# Altium schematic sheet jtag.SchDoc
size A
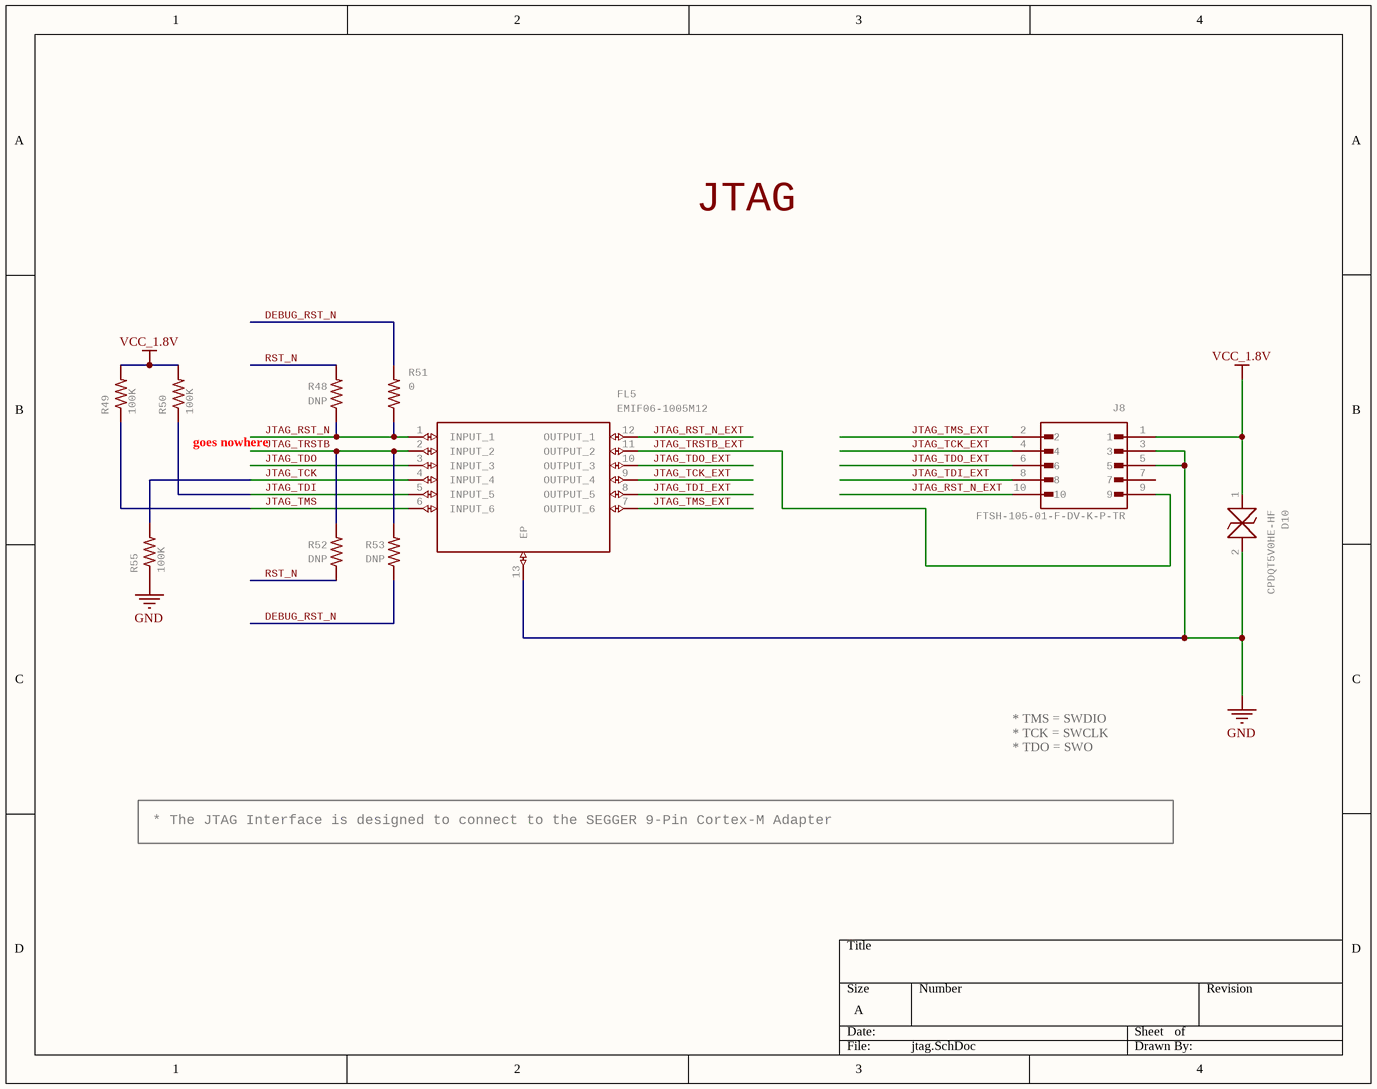
[diagram p0: jtag.SchDoc]

## Parts
D10  CPDQT5V0HE-HF  [CPDQT5V0HEHF]
FL5  EMIF06-1005M12  [SON40P150X250X65-13N]
J8  FTSH-105-01-F-DV-K-P-TR  [CNC_3221-10-0300-00]
R48  DNP  [0402-RES]
R49  100K  [R0201]
R50  100K  [R0201]
R51  0  [0402-RES]
R52  DNP  [0402-RES]
R53  DNP  [0402-RES]
R55  100K  [R0201]

## Nets
GND: D10.2 FL5.13(EP) J8.3 J8.5 R55.1
VCC_1.8V: D10.1 J8.1 R49.2 R50.2
DEBUG_RST_N: R51.2 R53.1
JTAG_RST_N: FL5.1(INPUT_1) R48.1 R51.1
JTAG_RST_N_EXT: FL5.12(OUTPUT_1) J8.10
JTAG_TCK: FL5.4(INPUT_4) R55.2
JTAG_TCK_EXT: FL5.9(OUTPUT_4) J8.4
JTAG_TDI: FL5.5(INPUT_5) R50.1
JTAG_TDI_EXT: FL5.8(OUTPUT_5) J8.8
JTAG_TDO: FL5.3(INPUT_3)
JTAG_TDO_EXT: FL5.10(OUTPUT_3) J8.6
JTAG_TMS: FL5.6(INPUT_6) R49.1
JTAG_TMS_EXT: FL5.7(OUTPUT_6) J8.2
JTAG_TRSTB: FL5.2(INPUT_2) R52.2 R53.2
JTAG_TRSTB_EXT: FL5.11(OUTPUT_2) J8.9
RST_N: R48.2 R52.1

Not connected (* = marked no-connect by the designer): J8 7

## Notes on the sheet
- JTAG
- (near R50) goes nowhere
- * The JTAG Interface is designed to connect to the SEGGER 9-Pin Cortex-M Adapter
- * TMS = SWDIO
  * TCK = SWCLK
  * TDO = SWO

## Library data of the parts
D10 = CPDQT5V0HE-HF: ESD Suppressors / TVS Diodes DIODE ESD 5VWM 65W 0402/SOD-923F   Source:  Datasheet; MANUFACTURER_NAME: Comchip Technology; GateName_1: G$1; SymbolName_1: CPDQT5V0HE-HF; LibraryName: CPDQT5V0HE-HF; DeviceSetName: CPDQT5V0HE-HF; HEIGHT: 0.42mm; MANUFACTURER_PART_NUMBER: CPDQT5V0HE-HF; MOUSER_PART_NUMBER: MOUSER_PART_NUMBER; MOUSER_PRICE-STOCK: MOUSER_PRICE-STOCK; MPN: CPDQT5V0HE-HF; Part Number: CPDQT5V0HE-HF
FL5 = EMIF06-1005M12: EMI Filter Circuits 6lin lw cpcitnc EMI 45pF -35db @ 900MHz   Source:  Datasheet; MANUFACTURER_NAME: STMicroelectronics; GateName_1: G$1; SymbolName_1: EMIF06-1005M12; LibraryName: EMIF06-1005M12; DeviceSetName: EMIF06-1005M12; HEIGHT: 0.65mm; MANUFACTURER_PART_NUMBER: EMIF06-1005M12; MOUSER_PART_NUMBER: 511-EMIF06-1005M12; MOUSER_PRICE-STOCK: https://www.mouser.co.uk/ProductDetail/STMicroelectronics/EMIF06-1005M12?qs=VJaATVMq%252BXo0u09ZqtQg3A%3D%3D; MPN: EMIF06-1005M12; Part Number: EMIF06-1005M12
J8 = 3221-10-0300-00: Check availability; GateName_1: G$1; MF: CNC Tech; SymbolName_1: 3221-10-0300-00; LibraryName: 3221-10-0300-00; DeviceSetName: 3221-10-0300-00; AVAILABILITY: In Stock; MP: FTSH-105-01-F-DV-K-P-TR; MPN: FTSH-105-01-F-DV-K-P-TR; PACKAGE: None; PRICE: None; PURCHASE-URL: https://pricing.snapeda.com/search/part/3221-10-0300-00/?ref=eda; Part Number: FTSH-105-01-F-DV-K-P-TR
R48 R52 R53 = RESISTOR0402-RES: ResistorBasic schematic elements and footprints for 0603, 1206, and PTH resistors.; GateName_1: G$1; SymbolName_1: RESISTOR; DeviceName: 0402-RES; LibraryName: sfe; DeviceSetName: RESISTOR
R49 R50 R55 = RESISTOR0402-RES: GateName_1: G$1; SymbolName_1: RESISTOR; LibraryName: sfe; DeviceSetName: RESISTOR
R51 = RESISTOR0402-RES: ResistorBasic schematic elements and footprints for 0603, 1206, and PTH resistors.; MPN: RC0402JR-070R; GateName_1: G$1; SymbolName_1: RESISTOR; DeviceName: 0402-RES; LibraryName: sfe; DeviceSetName: RESISTOR; Part Number: RC0402JR-070R